# EAGLE design keyboard (EAGLE 7.7.0)
DRAWING_NUMBER: V001; DRAWN: Mario Blunk / Blunk electronic; PROJECT: agile HW demo; STATUS: development

## Sheet 1 of 3: push button
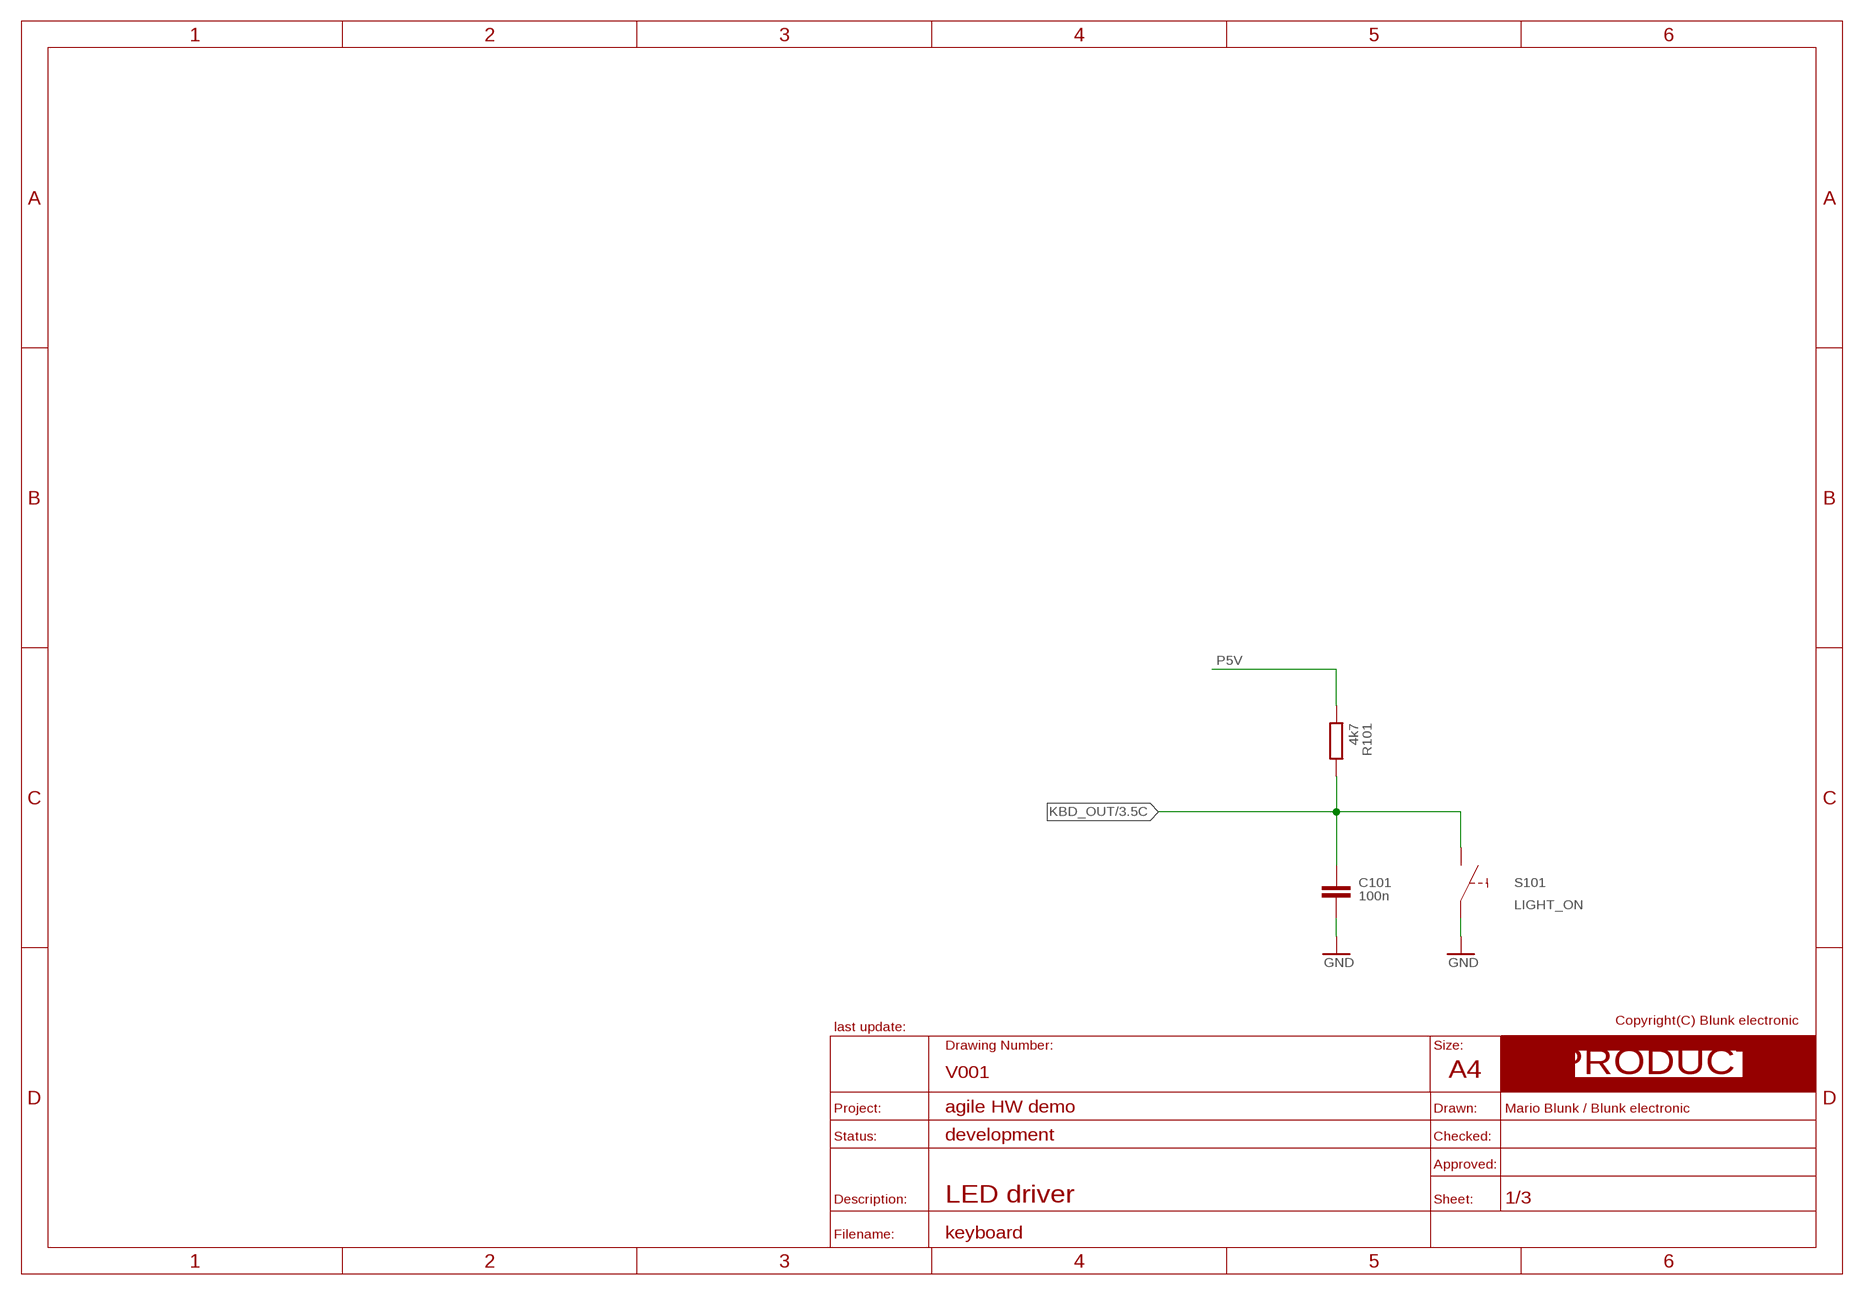
[diagram p0: schematic, sheet 1]
FRAME_PRODUCT1 (A4_LANDSCAPE_PRODUCT): BOM: NO; COMMISSIONED: 2013-08-30; DESCRIPTION: LED driver

### Parts
C101  100n  C_S_0805  [S_0805]
R101  4k7  R_S_0805  [S_0805]
S101  PUSH_BUTTON_S_6X6MM  [S_PUSH_BUTTON_6X6]

### Nets
GND: C101.2 S101.A1 S101.A(A1) ; also sheet 2,3
KBD_OUT: C101.1 R101.2 S101.B1 S101.B(B1) ; also sheet 3
P5V: R101.1 ; also sheet 2

## Sheet 2 of 3: keyboard mdule pwr supply
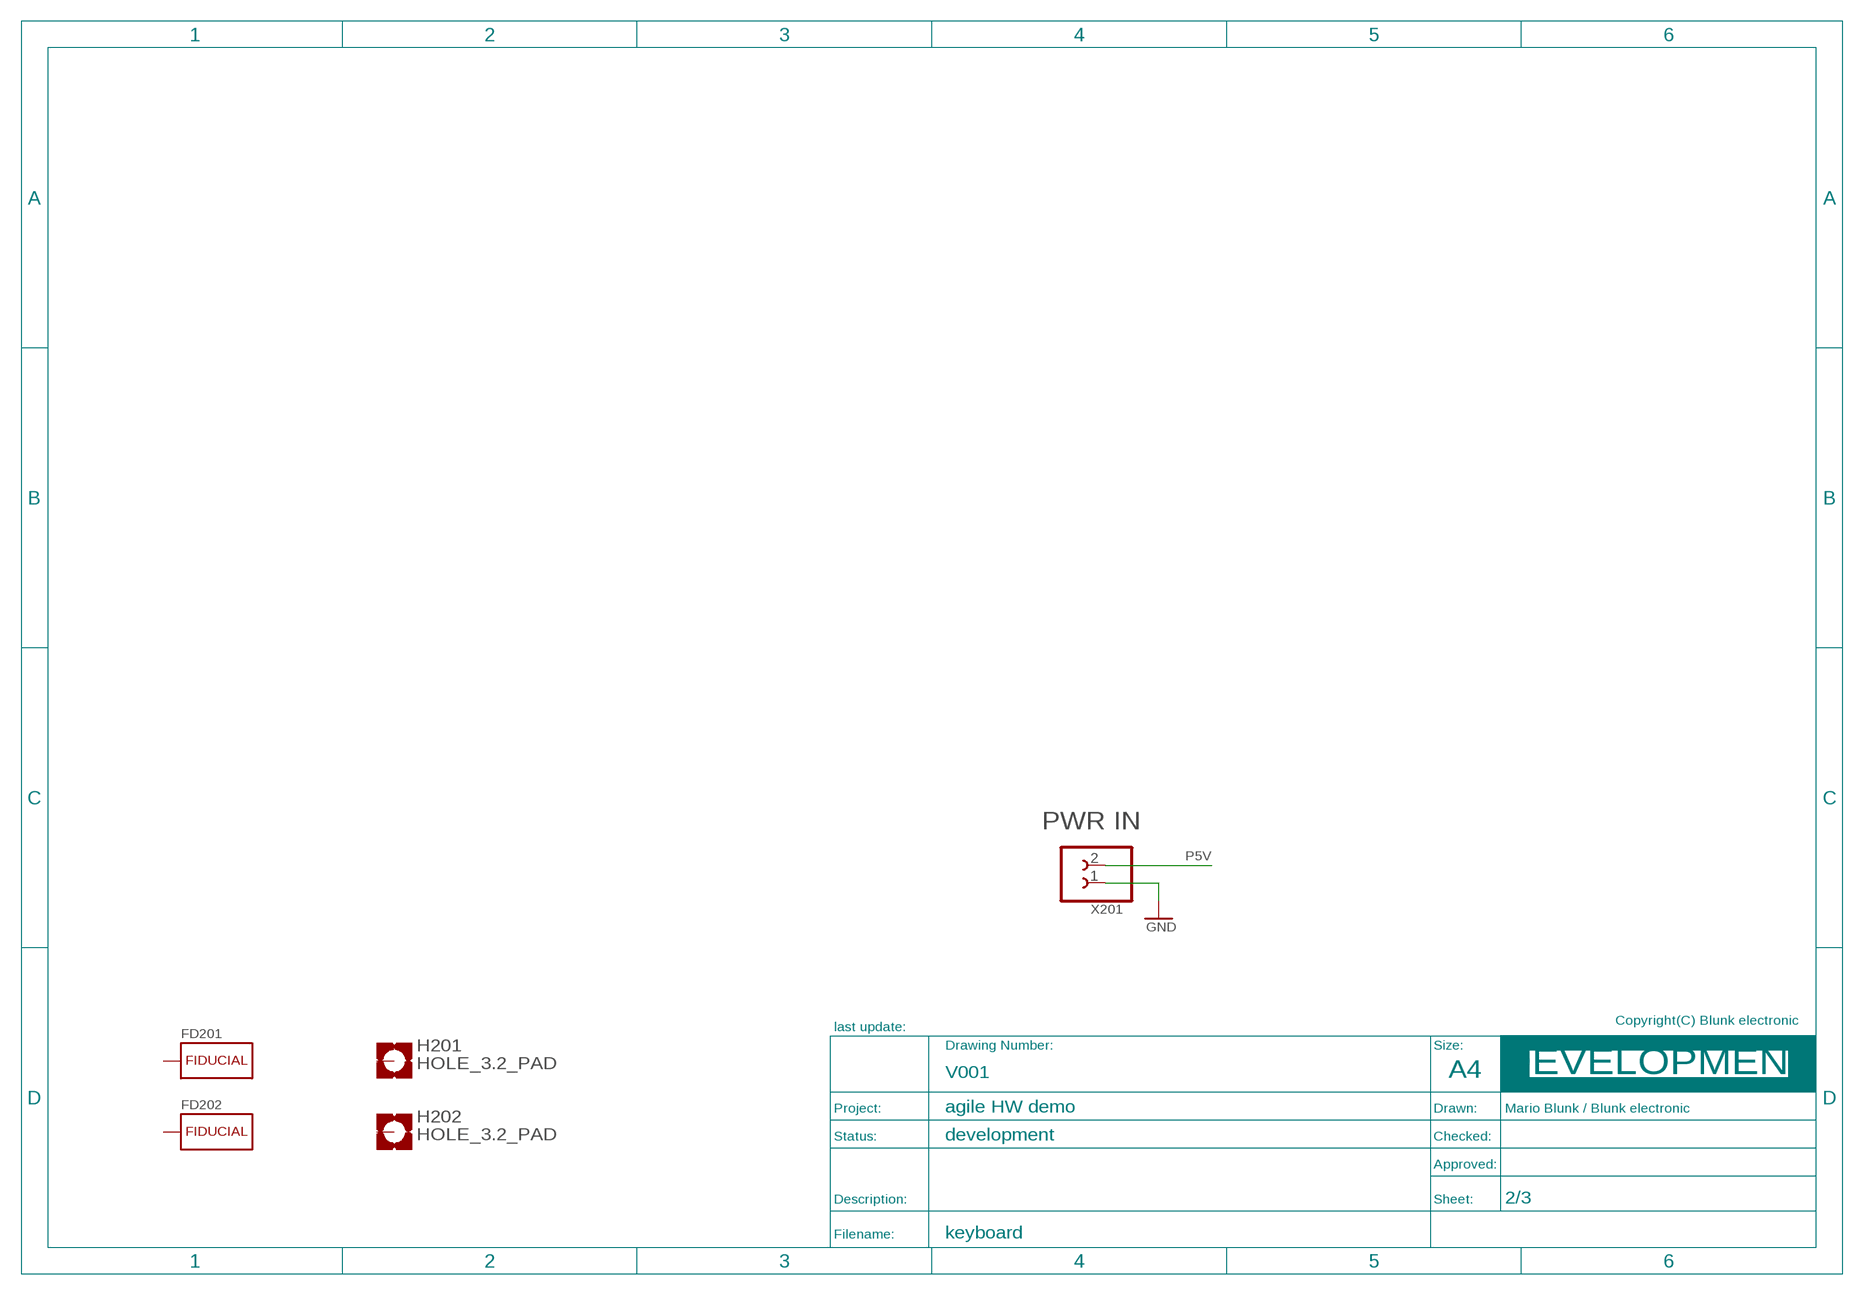
[diagram p1: schematic, sheet 2]
FRAME_DEVELOPMENT1 (A4_LANDSCAPE_DEVELOPMENT): BOM: NO; COMMISSIONED: 2013-08-30

### Parts
FD201  FIDUCIAL_CROSSHAIR  [CROSSHAIR]
FD202  FIDUCIAL_CROSSHAIR  [CROSSHAIR]
H201  HOLE_3.2_PAD  [3.2_PAD]
H202  HOLE_3.2_PAD  [3.2_PAD]
X201  CLAMP_1X2-T-2.5MM  [T_WIRE_CLAMP_1X2_PITCH_2MM5]

### Nets
GND: X201.1 ; also sheet 1,3
P5V: X201.2 ; also sheet 1
Unconnected: FD201.1(NC) FD202.1(NC) H201.H1(MOUNT) H202.H1(MOUNT)

## Sheet 3 of 3: keyboard mdule backend
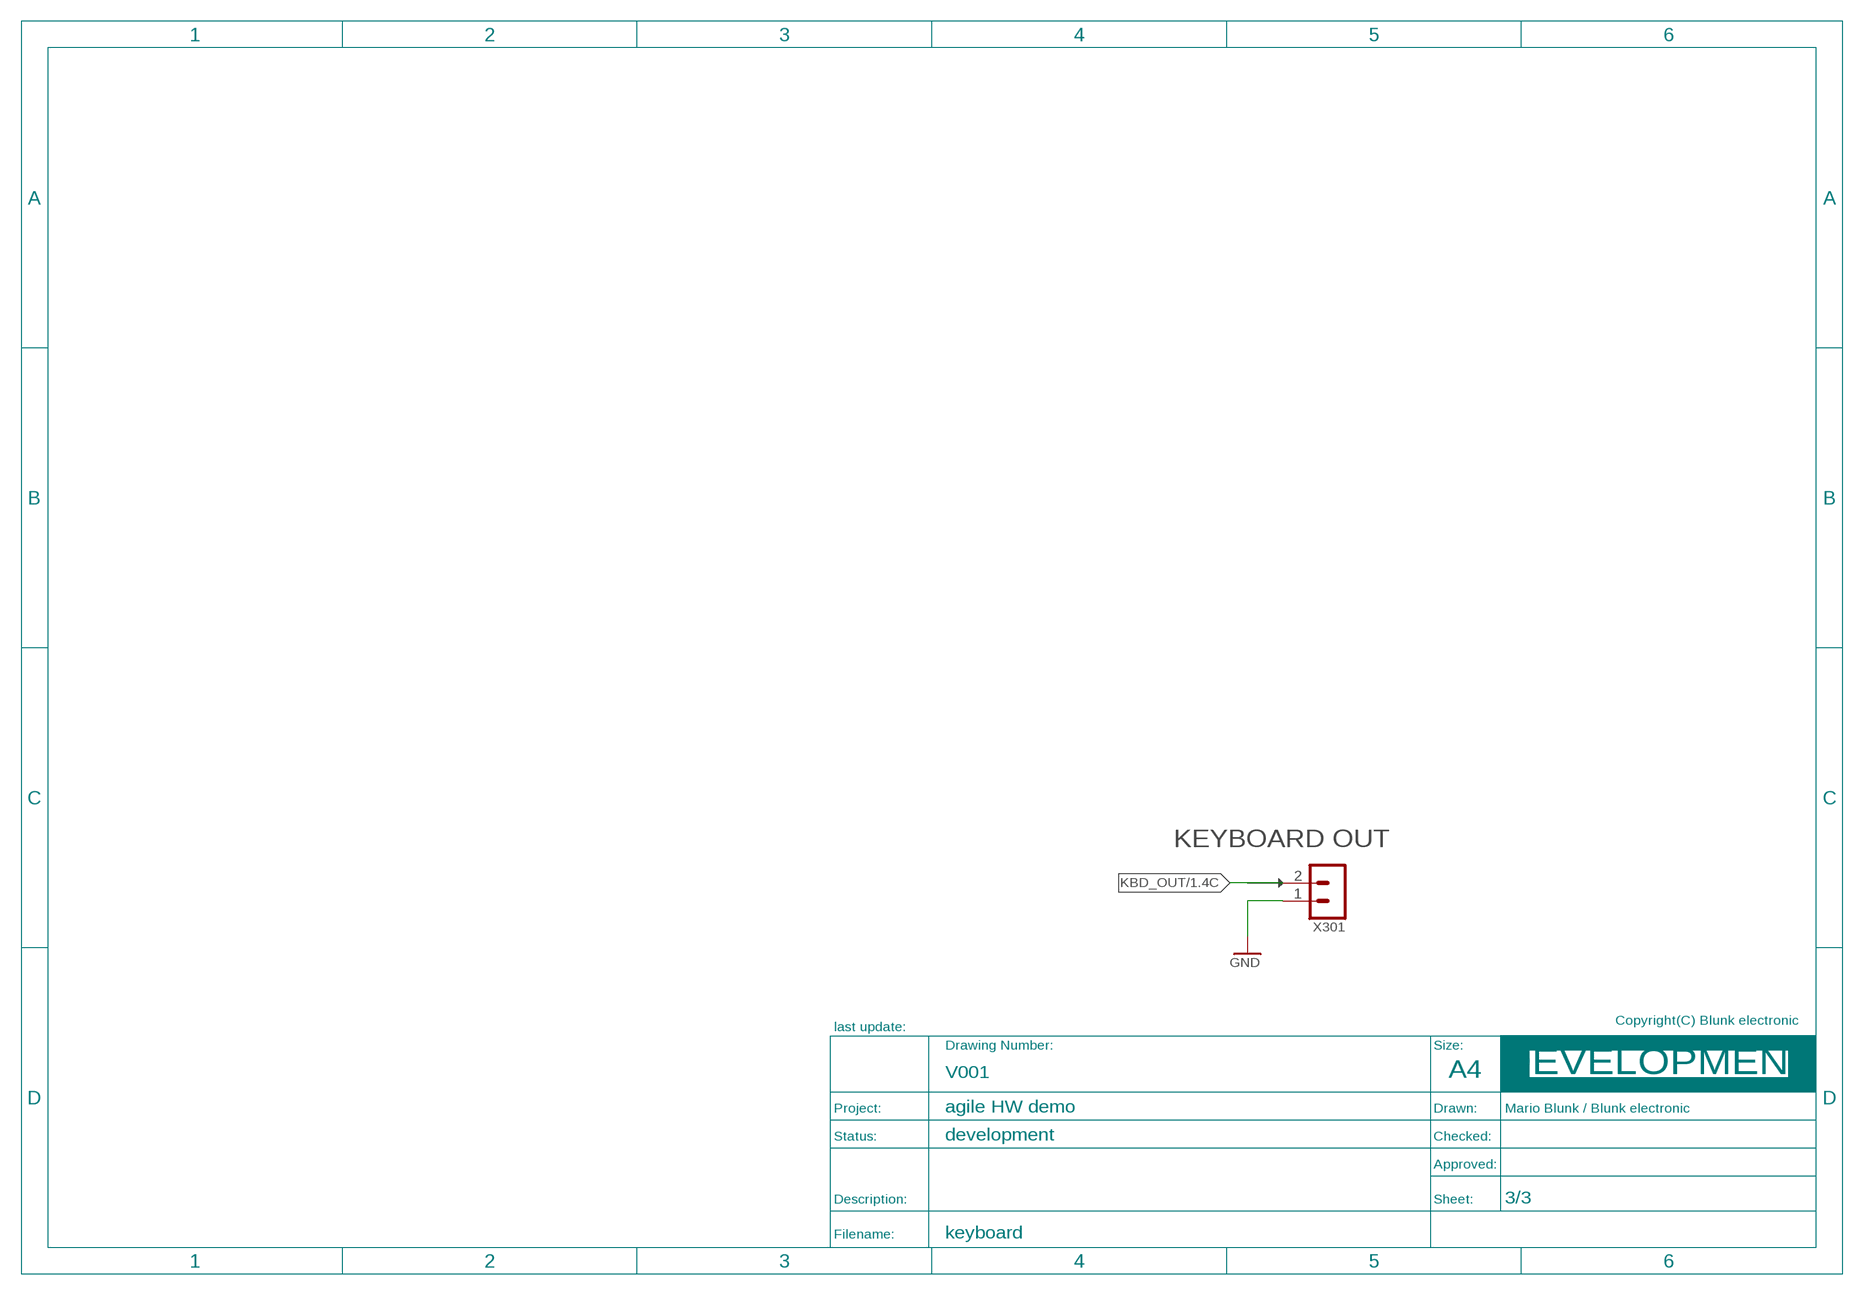
[diagram p2: schematic, sheet 3]
FRAME_DEVELOPMENT2 (A4_LANDSCAPE_DEVELOPMENT): BOM: NO; COMMISSIONED: 2013-08-30
U$6 (ARROW_1): BOM: NO; COMMISSIONED: 2013-08-30

### Parts
X301  MALE_2X1-T-VERTICAL  [T_MALE_2X1_VERTICAL_PITCH_2MM54]

### Nets
GND: X301.1 ; also sheet 1,2
KBD_OUT: X301.2 ; also sheet 1

## Library data of the parts
C101 = be_rcl:C: drawn: Mario Blunk / Blunk electronic; BOM: YES; COMMISSIONED: 2013-08-30; PART_CODE_BEL: C_PAC_S_0805_VAL_100n
FD201 FD202 = be_marks:FIDUCIAL: drawn: Mario Blunk / Blunk electronic; BOM: NO; COMMISSIONED: 2013-12-03
H201 H202 = be_holes:HOLE: edited: Mario Blunk; BOM: NO; COMMISSIONED: 2015-01-15
R101 = be_rcl:R: edited: Mario Blunk / Blunk electronic; BOM: YES; COMMISSIONED: 2013-08-30; PART_CODE_BEL: R_PAC_S_0805_VAL_4k7
S101 = be_switch:PUSH_BUTTON: edited: Mario Blunk; BOM: YES; COMMISSIONED: 2013-08-30; FUNCTION: LIGHT_ON; PART_CODE_BEL: S_PAC_S_PUSH_BUTTON_6X6
X201 = be_con_jump:CLAMP_1X2: drawn: Mario Blunk / Blunk electronic; BOM: YES; COMMISSIONED: 2014-04-14; FUNCTION: PWR IN; PART_CODE_BEL: X_PAC_T_CLAMP_1X2_PITCH_2mm5
X301 = be_con_jump:MALE_2X1: edited: Mario Blunk / Blunk electronic; BOM: YES; COMMISSIONED: 2013-08-30; FUNCTION: KEYBOARD OUT; PART_CODE_BEL: X_PAC_T_MALE_2X1_VERTICAL_PITCH_2mm54; UPDATED: 2018-08-01

## Board
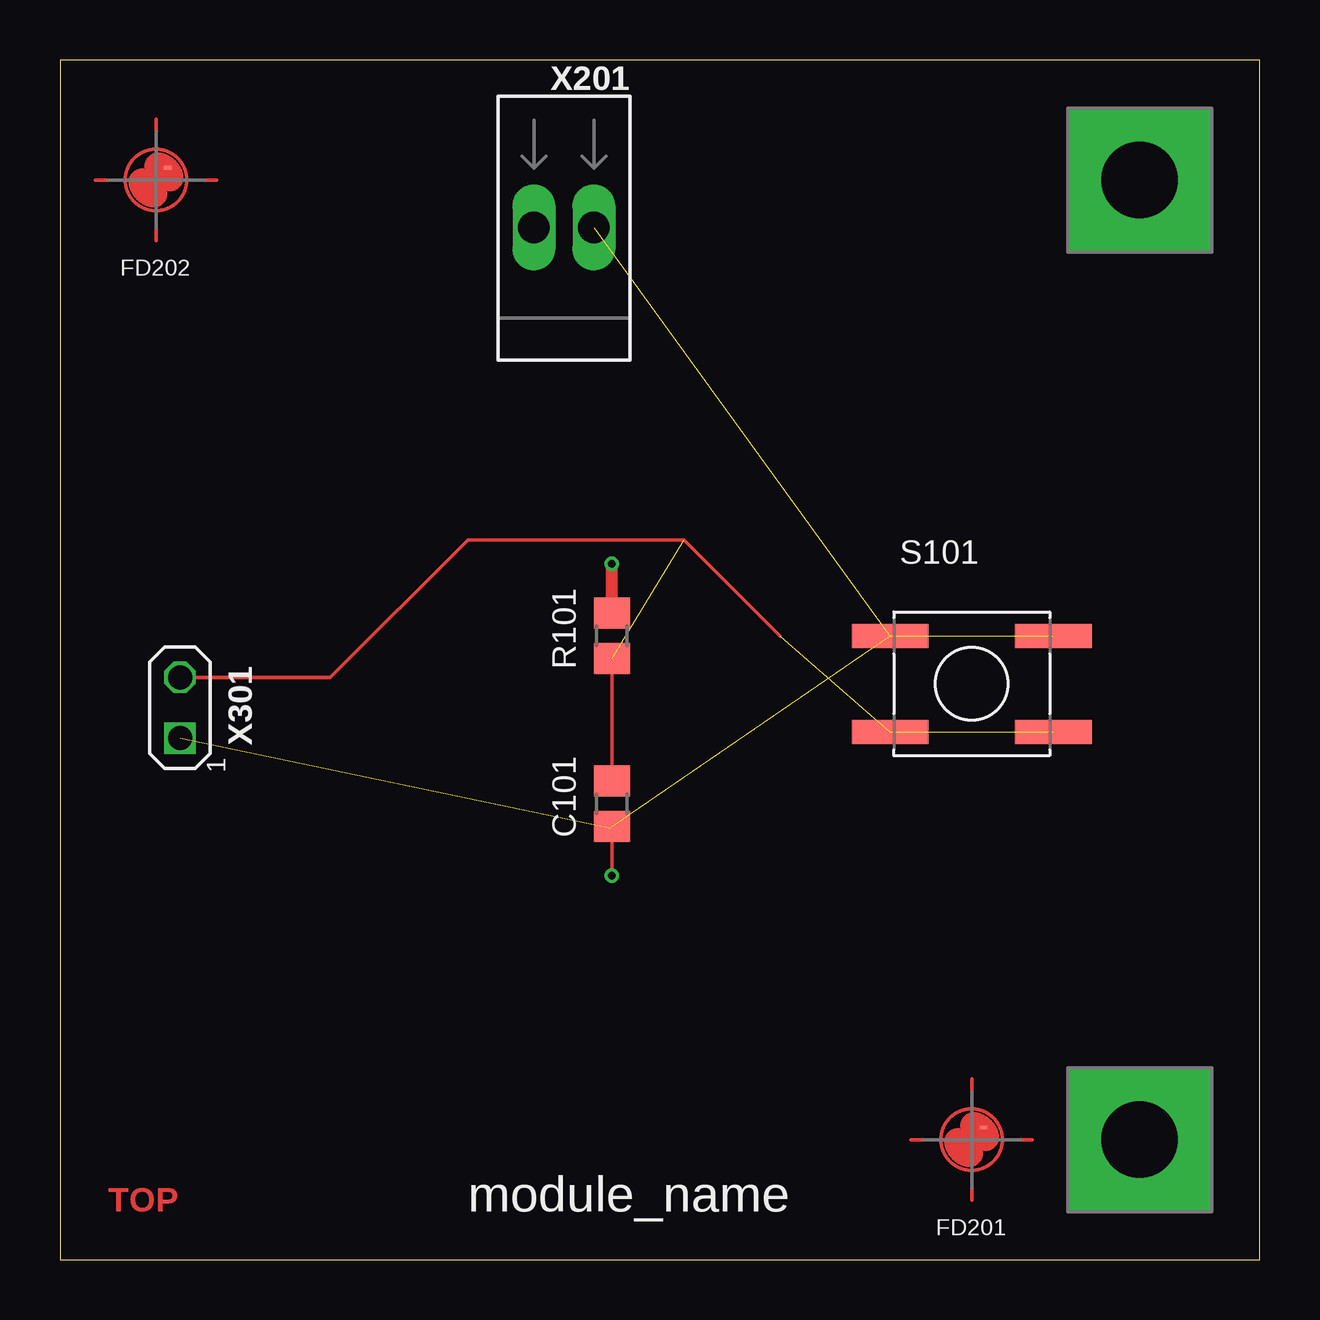
[diagram p3: board, top side]
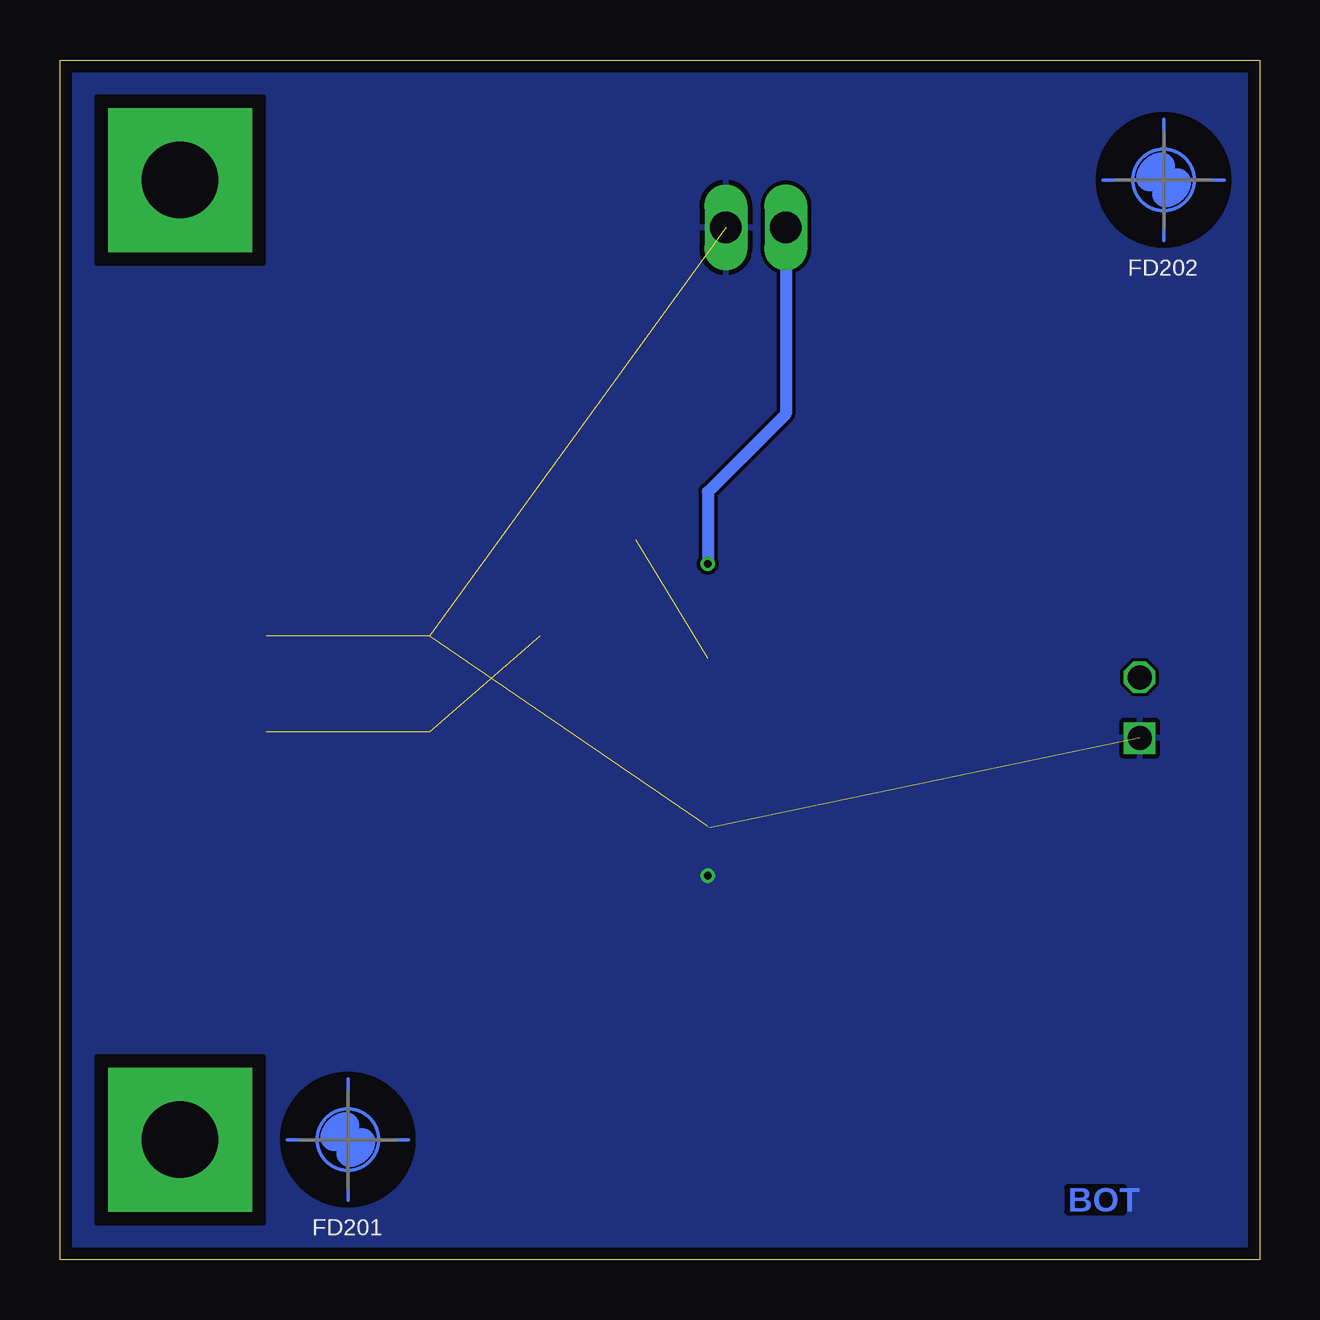
[diagram p4: board, bottom side, seen from below]

Size 50 x 50 mm. Coordinates in mm from the lower left corner, seen from the top.
Outline: 0,0 50,0 50,50 0,50 0,0
Copper layers (1+2*15+16): Top 0.018mm / dielectric 0.37mm / Route2 0.035mm / dielectric 0.65mm / Route15 0.035mm / dielectric 0.37mm / Bottom 0.018mm
Design rules "JLP_ML4_std": minimum track width 0.15mm, minimum drill 0.3mm, track to track 0.15mm, track to pad 0.15mm, pad to pad 0.15mm, via to via 0.15mm, smd to smd 0.15mm, copper to edge 0.5mm, drill to drill 0.2mm, minimum pad ring 0.15mm, minimum via ring 0.15mm, stop-mask expansion 0.075mm, vias tented up to drill 0.3mm, thermal gap 0.2mm

### Footprints (pad centres in the part's own frame; a part is rotated, then mirrored left to right if it is on the bottom)
S_0805 = smd 1.3 x 1.5: 1 -0.95,0; 2 0.95,0
CROSSHAIR = smd 0.305 x 0.152: 1 0.5,0.5
3.2_PAD = drill 3.2 pad 6 square: H1 0,0
S_PUSH_BUTTON_6X6 = smd 3.2 x 1: A -3.4,2; A1 3.4,2; B -3.4,-2; B1 3.4,-2
T_WIRE_CLAMP_1X2_PITCH_2MM5 = drill 1.3 pad 1.8 long: 1 -1.25,-0.02; 2 1.25,-0.02
T_MALE_2X1_VERTICAL_PITCH_2MM54 = drill 1 square: 1 0,-1.27 | drill 1 octagon: 2 0,1.27

### Placement (x,y rotation side)
C101  23,19 270 top
FD201  38,5 0 top
FD202  4,45 0 top
H201  45,45 0 top
H202  45,5 0 top
R101  23,26 270 top
S101  38,24 0 top
U$5  [A4_LANDSCAPE]  -165,-46 0 top  (outside the outline)
X201  21,43 180 top
X301  5,23 0 top

### Tracks (layer width: path | path; a pad name or v marks a point on that pad's centre or on a via)
GND  (via drill 0.3)  (4 unrouted)
  Top 0.15: C101.2 22.95,18 23,18 v23,16
  pour Bottom: 0,50 50,50 50,0 0,0
  pour Bottom: 0,50 50,50 50,0 0,0
KBD_OUT  (3 unrouted)
  Top 0.15: X301.2 11.27,24.27 17,30 26,30 30,26 | R101.2 23,22 C101.1
P5V  (via drill 0.3)
  Top 0.5: R101.1 v23,29
  Bottom 0.5: X201.2 19.75,35.25 23,32 v23,29

### Text on the board
Top: TOP
Bottom: BOT
tPlace: module_name